# Altium schematic sheet B155AA.SchDoc: B155AA
size 292 x 193 mm; SheetNumber: 1; SheetTotal: 5
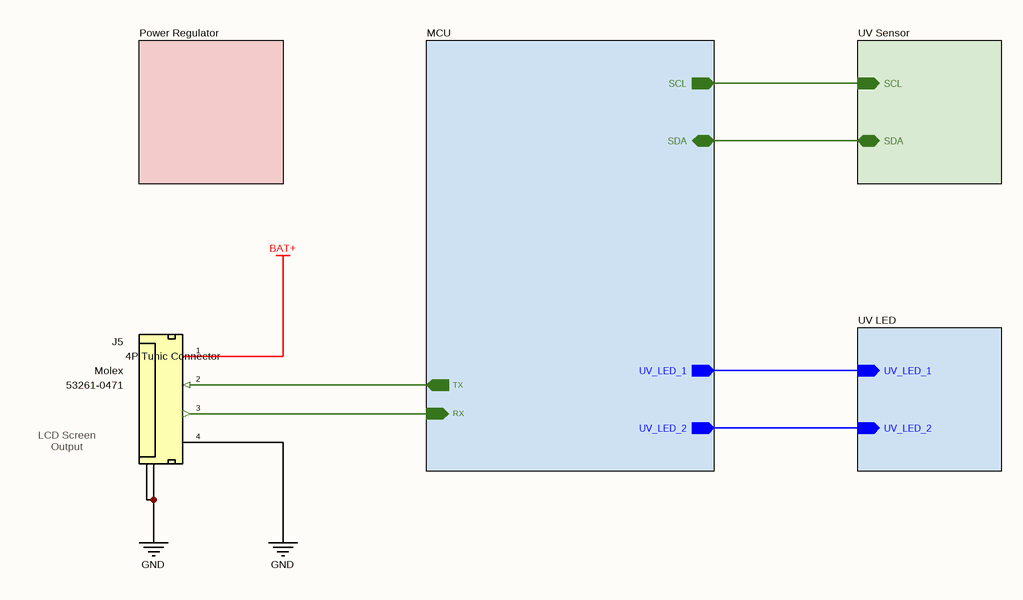
[diagram p0: B155AA.SchDoc]

## Parts
J5  Manufacturer Name: Molex  Manufacturer Part Number: 53261-0471  [Connector_Tunic 4P]  (hidden comment: 4P SMD Tunic Connector)

## Sub-sheets
MCU = MCU.SchDoc: SCL (out), SDA (bidir), UV_LED_1 (out), UV_LED_2 (out), RX (in), TX (out)
Power Regulator = 3V3 Regulator.SchDoc: no entries
UV LED = UV LED.SchDoc: UV_LED_1 (in), UV_LED_2 (in)
UV Sensor = UV Sensor.SchDoc: SCL (in), SDA (bidir)

## Nets
BAT+: J5.1(BAT+)
GND: J5.4(BAT-) J5.5(GND) J5.6(GND)
NetJ5_2: J5.2(TX) ; sheet MCU/TX
NetJ5_3: J5.3(RX) ; sheet MCU/RX
(unnamed): sheet MCU/SCL, sheet UV Sensor/SCL
(unnamed): sheet MCU/SDA, sheet UV Sensor/SDA
(unnamed): sheet MCU/UV_LED_1, sheet UV LED/UV_LED_1
(unnamed): sheet MCU/UV_LED_2, sheet UV LED/UV_LED_2

## Notes on the sheet
- (near J5) LCD Screen Output
- © 2022 All rights reserved.
  This document may not, in whole or in part, be copied, photocopied, reproduced, translated or converted to any electronic or machine readable from without prior written permission of Mehmet Günce Akkoyun.
  Engineer contact : akkoyun@me.com
- Property of
- Engineer :
- Date :
- Size :
- A4
- Time :
- Project :
- Page :
- /
- Customer :
- Product ID :
- Module ID :
- Version :
- File :
- Revision :
- (in symbol Connector - Mini Tunic 4P (1.25)) 4P Tunic Connector

## Library data of the parts
J5 = Connector - Mini Tunic 4P (1.25): Mini Tunic Connector with 4P; Pitch: 1.25mm; Position: 4; ROHS: Yes; ComponentLink1Description: DataSheet; ComponentLink1URL: https://www.mouser.com.tr/datasheet/2/276/0532610471_PCB_HEADERS-170942.pdf; ComponentLink2Description: Mouser; ComponentLink2URL: https://www.mouser.com.tr/ProductDetail/Molex/53261-0471?qs=%2Fha2pyFaduhLhIsk8tywtK7BwWtguBSP4XxyDBTOTfs%3D; Case: SMD